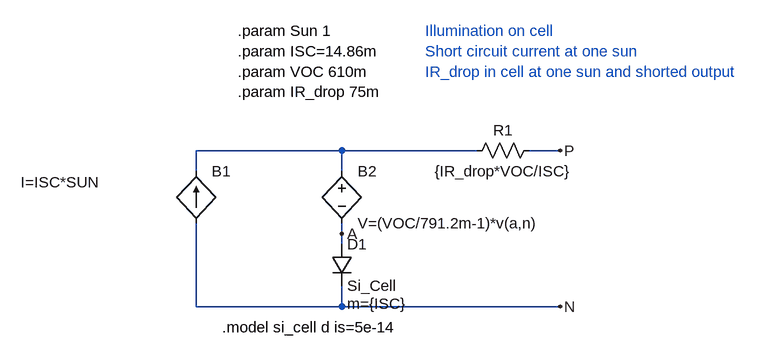
[diagram p0: schematic Generic_solar_panel_2.asc]
Generic_solar_panel_2.asc, the LTspice schematic file:
Version 4
SHEET 1 880 680
WIRE 176 96 -48 96
WIRE 384 96 176 96
WIRE 512 96 464 96
WIRE -48 128 -48 96
WIRE 176 128 176 96
WIRE 176 224 176 208
WIRE 176 240 176 224
WIRE -48 336 -48 208
WIRE 176 336 176 304
WIRE 176 336 -48 336
WIRE 512 336 176 336
FLAG 512 96 P
FLAG 512 336 N
FLAG 176 224 A
SYMBOL bi2 -48 128 R0
WINDOW 3 -270 17 Left 2
SYMATTR Value I=ISC*SUN
SYMATTR InstName B1
SYMBOL diode 160 240 R0
WINDOW 123 24 92 Left 2
SYMATTR Value2 m={ISC}
SYMATTR InstName D1
SYMATTR Value Si_Cell
SYMBOL res 368 112 R270
WINDOW 0 32 56 VTop 2
WINDOW 3 0 56 VBottom 2
SYMATTR InstName R1
SYMATTR Value {IR_drop*VOC/ISC}
SYMBOL bv 176 112 R0
SYMATTR InstName B2
SYMATTR Value V=(VOC/791.2m-1)*v(a,n)
TEXT -8 368 Left 2 !.model si_cell d is=5e-14
TEXT 16 -88 Left 2 !.param Sun 1\n.param ISC=14.86m\n.param VOC 610m\n.param IR_drop 75m
TEXT 304 -88 Left 2 ;Illumination on cell\nShort circuit current at one sun\nIR_drop in cell at one sun and shorted output

The netlist it stands for:
* Generic_solar_panel_2.asc
B1 N N001 I=ISC*SUN
D1 A N Si_Cell m={ISC}
R1 N001 P {IR_drop*VOC/ISC}
B2 N001 A V=(VOC/791.2m-1)*v(a,n)
.model D D
.lib standard.dio
.model si_cell d is=5e-14
.param Sun 1
.param ISC=14.86m
.param VOC 610m
.param IR_drop 75m
* Illumination on cell
* Short circuit current at one sun
* IR_drop in cell at one sun and shorted output
.backanno
.end